# Altium schematic sheet E17-04-INDUCTIVE_LOAD_SWITCH.SchDoc
size A; DocumentNumber: 7; SheetNumber: 7; SheetTotal: 9
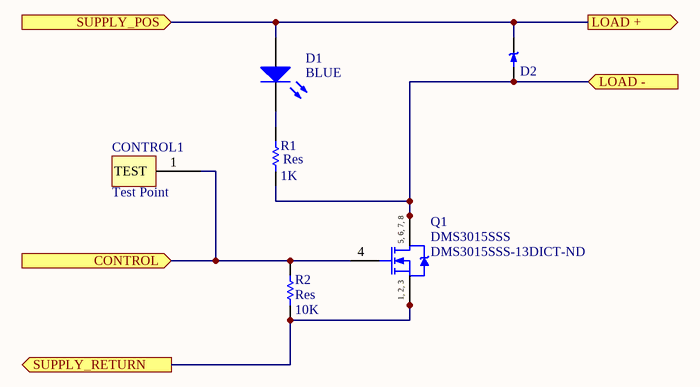
[diagram p0: E17-04-INDUCTIVE_LOAD_SWITCH.SchDoc]

## Parts
CONTROL1  Test Point  [TEST POINT 5000K]
D1  Colour: BLUE  [OVS5MBBCR4]  (hidden comment: OVS5MBBCR4)
D2  PMEG4010ET  [SOT23-3]  (value not drawn)
Q1  DMS3015SSS  Supplier Part Number 1: DMS3015SSS-13DICT-ND  [SOIC-8-150]
R1  Res  value 1K  [2012[0805]]
R2  Res  value 10K  [2012[0805]]

## Ports
CONTROL (in), LOAD + (out), LOAD - (in), SUPPLY_POS (in), SUPPLY_RETURN (out)

## Nets
CONTROL: CONTROL1.1(TEST) Q1.4(G) R2.2 ; port CONTROL
LOAD +: D1.1(A) D2.3 ; port SUPPLY_POS, port LOAD +
LOAD -: D2.1 Q1.5(D) Q1.6(D) Q1.7(D) Q1.8(D) R1.1 ; port LOAD -
SUPPLY_RETURN: Q1.1(S) Q1.2(S) Q1.3(S) R2.1 ; port SUPPLY_RETURN
NetD1_2: D1.2(K) R1.2

## Notes on the sheet
- (in symbol DMS3015SSS) 5, 6, 7, 8; 1, 2, 3

## Library data of the parts
CONTROL1 = Test Point: 5000-5004, 5015-5019 Keystone Electronics
D1 = OVS5MBBCR4: Typical BLUE LED; Published: 8-Jun-2000; LatestRevisionDate: 17-Jul-2002; LatestRevisionNote: Re-released for DXP Platform.; PackageDocument: Feb-2002; PackageReference: 3.2X1.6X1.1; Publisher: Altium Limited; Supplier 1: Digi-Key; Supplier Part Number 1: 365-1544-1-ND
D2 = PMEG4010ET: SCHOTTKY RECT 40V 1A SOT-23; Supplier 1: Digi-Key; Supplier Part Number 1: 568-4103-6-ND
Q1 = DMS3015SSS: N-Channel Power MOSFET; Supplier 1: Digi-Key
R1 R2 = Res: Surface Mount Resistor; Published: 8-Jun-2000; LatestRevisionDate: 17-Jul-2002; LatestRevisionNote: Re-released for DXP Platform.; PackageReference: AXIAL-0.5; Publisher: Altium Limited